# Altium project MWwater.PrjPcb
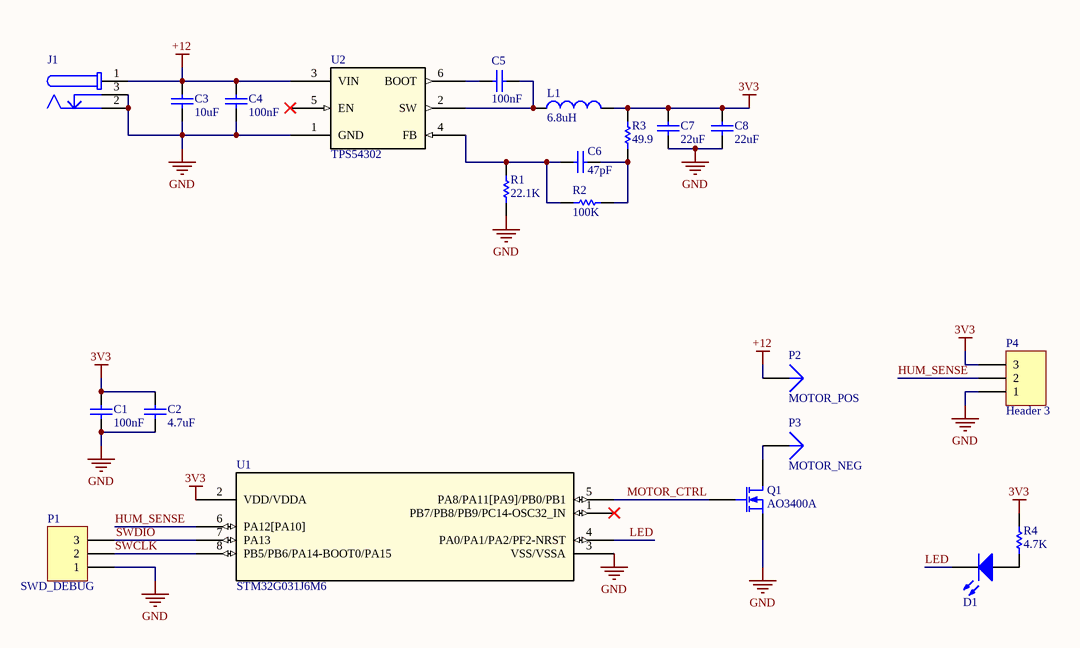
[diagram p0: sheet.SchDoc]
1 sheet, 22 parts. Net scope: global (net labels, ports and power ports of the same name join across sheets).
Board file: pcb.PcbDoc

## Sheet sheet.SchDoc
size A4

### Parts
C1  value 100nF  [CAP_0603]  (hidden comment: MLCC)
C2  value 4.7uF  [CAP_0603]  (hidden comment: MLCC)
C3  value 10uF  [CAP_0603]  (hidden comment: MLCC)
C4  value 100nF  [CAP_0603]  (hidden comment: MLCC)
C5  value 100nF  [CAP_0603]  (hidden comment: MLCC)
C6  value 47pF  [CAP_0603]  (hidden comment: MLCC)
C7  value 22uF  [CAP_0603]  (hidden comment: MLCC)
C8  value 22uF  [CAP_0603]  (hidden comment: MLCC)
D1  LED  [0603_GREEN]  (value not drawn)
J1  DC Power Jacks  [DC POWER JACK (1)]  (value not drawn)
L1  value 6.8uH  [INDWW_4mmSQ]  (hidden comment: Inductor)
P1  SWD_DEBUG  [HDR1X3]
P2  MOTOR_POS  [PIN1]
P3  MOTOR_NEG  [PIN1]
P4  Header 3  [HDR1X3]
Q1  AO3400A  [SOT-23/TO-236_318-08]
R1  value 22.1K  [RC0603N]  (hidden comment: RES)
R2  value 100K  [RC0603N]  (hidden comment: RES)
R3  value 49.9  [RC0603N]  (hidden comment: RES)
R4  value 4.7K  [RC0603N]  (hidden comment: RES)
U1  STM32G031J6M6  [SO8N]
U2  TPS54302  [DDC6]

### Nets
3V3: C1.2 C2.2 C7.1 C8.1 L1.2 P4.3 R3.2 R4.2 U1.2(VDD/VDDA)
+12: C3.2 C4.2 J1.1 P2.1 U2.3(VIN)
GND: C1.1 C2.1 C3.1 C4.1 C7.2 C8.2 J1.2 J1.3 P1.1 P4.1 Q1.3(S) R1.1 U1.3(VSS/VSSA) U2.1(GND)
HUM_SENSE: P4.2 U1.6(PA12[PA10])
LED: D1.2(K) U1.4(PA0/PA1/PA2/PF2-NRST)
MOTOR_CTRL: Q1.2(G) U1.5(PA8/PA11[PA9]/PB0/PB1)
SWCLK: P1.2 U1.8(PB5/PB6/PA14-BOOT0/PA15)
SWDIO: P1.3 U1.7(PA13)
NetC5_1: C5.1 L1.1 U2.2(SW)
NetC5_2: C5.2 U2.6(BOOT)
NetC6_1: C6.1 R1.2 R2.2 U2.4(FB)
NetC6_2: C6.2 R2.1 R3.1
NetD1_1: D1.1(A) R4.1
NetP3_1: P3.1 Q1.1(D)

Not connected (* = marked no-connect by the designer): U1 1(PB7/PB8/PB9/PC14-OSC32_IN)*; U2 5(EN)*

### Library data of the parts
C1-C8 = MLCC: Multilayer Ceramic Capacitors; VoltageRatingDC: 5V; Tolerance: 10%
D1 = LED: LED Emitters; ForwardVoltage: 2V
J1 = DC Power Jacks: DC Power Jack Connector with 4 soldering pads & Pegs WR-DC, Male, Right Angled, SMT, 5 A, 24 V; Built_By: Gordon Mak; ComponentLink1Description: Manufacturer; ComponentLink1URL: http://www.we-online.de; ComponentLink2Description: Datasheet; ComponentLink2URL: http://katalog.we-online.de/em/datasheet/6941xx106102.pdf
L1 = Inductor: Fixed Inductors; Impedance: 33mOhms; MaximumDCCurrent: 1A
P1 P4 = Header 3: Header, 3-Pin; LatestRevisionDate: 17-Jul-2002; LatestRevisionNote: Re-released for DXP Platform.; Publisher: Altium Limited
P2 P3 = Plug: LatestRevisionDate: 17-Jul-2002; LatestRevisionNote: Re-released for DXP Platform.; Publisher: Altium Limited
Q1 = MOSFET-N: N-Channel MOSFET; Published: 8-Jun-2000; LatestRevisionDate: 17-Jul-2002; LatestRevisionNote: Re-released for DXP Platform.; PackageVersion: 1995/1996; PackageReference: SOT-23; Publisher: Altium Limited; PackageDescription: TO, Flat Index; 3 In-Line, Axial Leads; Body Dia. 4.6mm; Lead Dia. 0.5 mm (max)
R1-R4 = RES: Chip Resistors; PowerRating: 0.25W
U1 = STM32G031J6M6: Arm® Cortex®-M0+ 32-bit MCU, up to 64 KB Flash, 8 KB RAM, / 2x USART, timers, ADC, comm. I/Fs, 1.7-3.6V; Vendor: STMicroelectronics; Built_By: EMA_UL_Team; SourceLibrary: Updates_to_database_2020-10-19; Manufacturer_Part_Number: STM32G031J6M6; Copyright: Copyright (C) 2018 Accelerated Designs. All rights reserved; RefDes: RefDes; Type: DEV
U2 = TPS54302: TPS54302 4.5-V to 28-V Input, 3-A Output, EMI Friendly / Synchronous Step-Down Converter; Manufacturer: Texas Instruments; Manufacturer_Part_Number: TPS54302DDCR; Built_By: Gordon Mak; Copyright: Copyright (C) 2020 MWLabs. All rights reserved; RefDes: RefDes; Type: DEV; Value: Value